# Altium project CPLDTester.PrjPCB
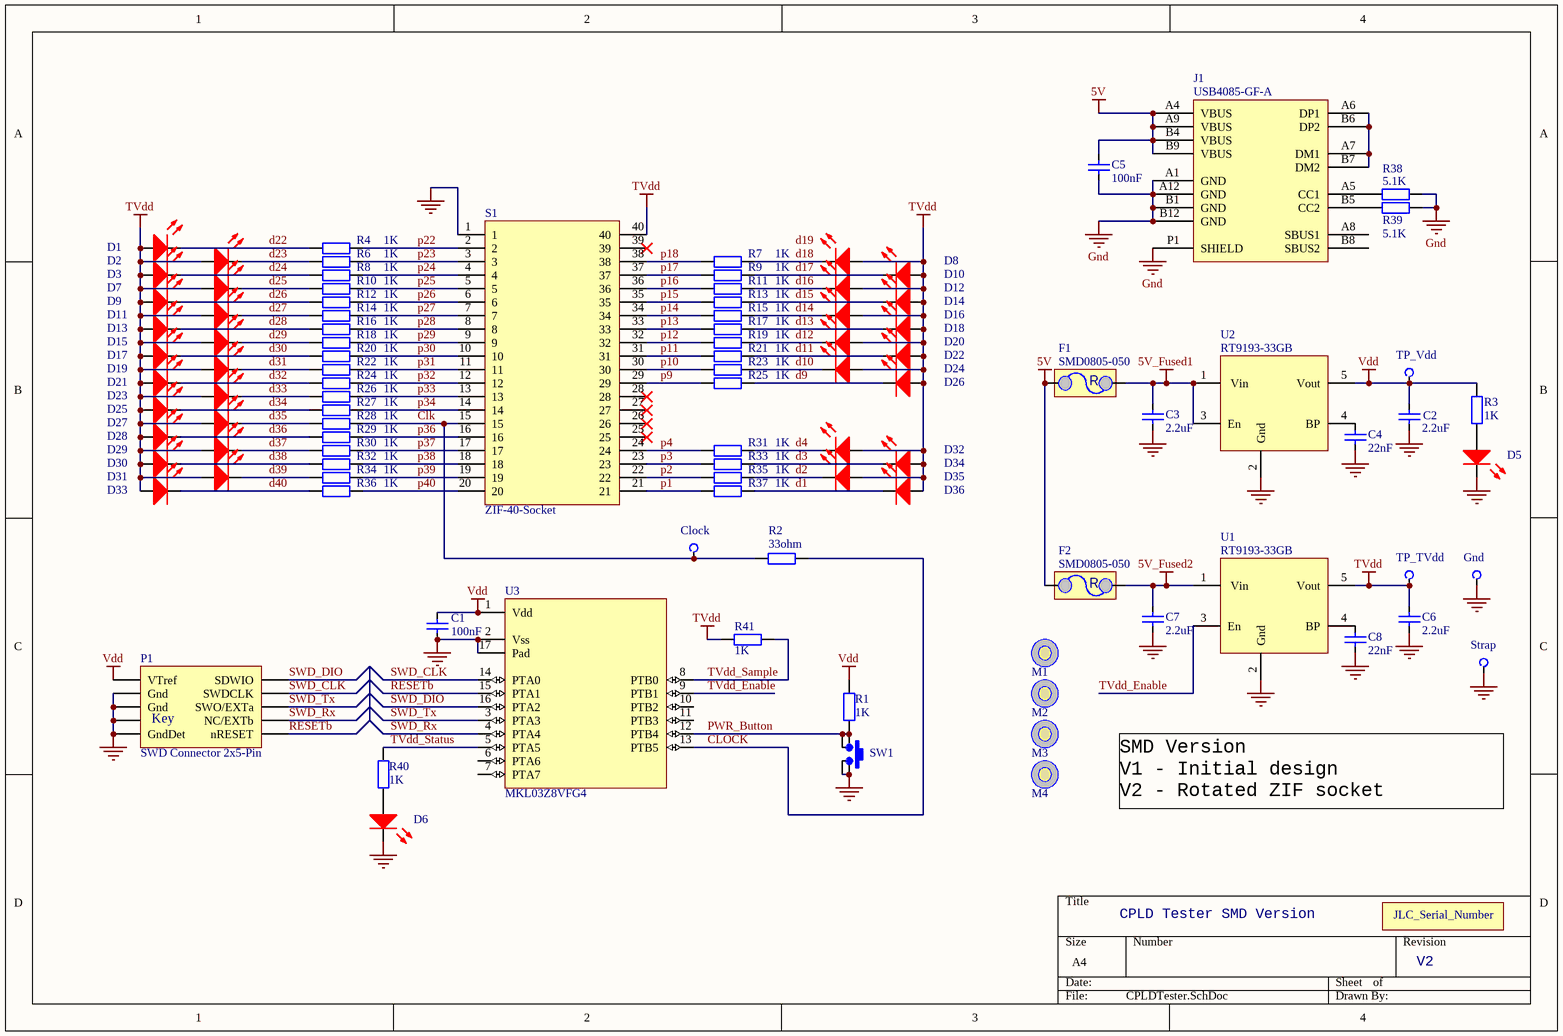
[diagram p0: CPLDTester.SchDoc]
ProjectDescription: CPLD Tester SMD Version; ProjectRevision: V2
1 sheet, 102 parts. Net scope: global (net labels, ports and power ports of the same name join across sheets).
Board file: CPLDTester.PcbDoc

## Sheet CPLDTester.SchDoc
size A4

### Parts
C1  100nF  [CCNP1608-0603]
C2  2.2uF  [CCNP1608-0603]
C3  2.2uF  [CCNP1608-0603]
C4  22nF  [CCNP1608-0603]
C5  100nF  [CCNP1608-0603]
C6  2.2uF  [CCNP1608-0603]
C7  2.2uF  [CCNP1608-0603]
C8  22nF  [CCNP1608-0603]
Clock  Clock  [PCBPIN - 0.9mm]  (value not drawn)
D1  LED Red  [LED1608-0603-RED]  (value not drawn)
D2  LED Red  [LED1608-0603-RED]  (value not drawn)
D3  LED Red  [LED1608-0603-RED]  (value not drawn)
D5  LED Red  [LED1608-0603-RED]  (value not drawn)
D6  LED Red  [LED1608-0603-RED]  (value not drawn)
D7  LED Red  [LED1608-0603-RED]  (value not drawn)
D8  LED Red  [LED1608-0603-RED]  (value not drawn)
D9  LED Red  [LED1608-0603-RED]  (value not drawn)
D10  LED Red  [LED1608-0603-RED]  (value not drawn)
D11  LED Red  [LED1608-0603-RED]  (value not drawn)
D12  LED Red  [LED1608-0603-RED]  (value not drawn)
D13  LED Red  [LED1608-0603-RED]  (value not drawn)
D14  LED Red  [LED1608-0603-RED]  (value not drawn)
D15  LED Red  [LED1608-0603-RED]  (value not drawn)
D16  LED Red  [LED1608-0603-RED]  (value not drawn)
D17  LED Red  [LED1608-0603-RED]  (value not drawn)
D18  LED Red  [LED1608-0603-RED]  (value not drawn)
D19  LED Red  [LED1608-0603-RED]  (value not drawn)
D20  LED Red  [LED1608-0603-RED]  (value not drawn)
D21  LED Red  [LED1608-0603-RED]  (value not drawn)
D22  LED Red  [LED1608-0603-RED]  (value not drawn)
D23  LED Red  [LED1608-0603-RED]  (value not drawn)
D24  LED Red  [LED1608-0603-RED]  (value not drawn)
D25  LED Red  [LED1608-0603-RED]  (value not drawn)
D26  LED Red  [LED1608-0603-RED]  (value not drawn)
D27  LED Red  [LED1608-0603-RED]  (value not drawn)
D28  LED Red  [LED1608-0603-RED]  (value not drawn)
D29  LED Red  [LED1608-0603-RED]  (value not drawn)
D30  LED Red  [LED1608-0603-RED]  (value not drawn)
D31  LED Red  [LED1608-0603-RED]  (value not drawn)
D32  LED Red  [LED1608-0603-RED]  (value not drawn)
D33  LED Red  [LED1608-0603-RED]  (value not drawn)
D34  LED Red  [LED1608-0603-RED]  (value not drawn)
D35  LED Red  [LED1608-0603-RED]  (value not drawn)
D36  LED Red  [LED1608-0603-RED]  (value not drawn)
F1  SMD0805-050  [SMD0805-050]
F2  SMD0805-050  [SMD0805-050]
Gnd  TP  [PCBPIN - 0.9mm]  (value not drawn)
J1  USB4085-GF-A  [USB4085-GF-A]
JLC_Serial_Number  JLC_Serial_Number  [JLC_Serial_Number]  (value not drawn)  (no BOM)
M1  Plastic Bumper  [Bumper_RBS-2]  (value not drawn)
M2  Plastic Bumper  [Bumper_RBS-2]  (value not drawn)
M3  Plastic Bumper  [Bumper_RBS-2]  (value not drawn)
M4  Plastic Bumper  [Bumper_RBS-2]  (value not drawn)
P1  SWD Connector 2x5-Pin  [SWD-2x5-Jig-Pads]  (no BOM)
R1  1K  [CR1608-0603]
R2  33ohm  [CR1608-0603]
R3  1K  [CR1608-0603]
R4  1K  [CR1608-0603]
R6  1K  [CR1608-0603]
R7  1K  [CR1608-0603]
R8  1K  [CR1608-0603]
R9  1K  [CR1608-0603]
R10  1K  [CR1608-0603]
R11  1K  [CR1608-0603]
R12  1K  [CR1608-0603]
R13  1K  [CR1608-0603]
R14  1K  [CR1608-0603]
R15  1K  [CR1608-0603]
R16  1K  [CR1608-0603]
R17  1K  [CR1608-0603]
R18  1K  [CR1608-0603]
R19  1K  [CR1608-0603]
R20  1K  [CR1608-0603]
R21  1K  [CR1608-0603]
R22  1K  [CR1608-0603]
R23  1K  [CR1608-0603]
R24  1K  [CR1608-0603]
R25  1K  [CR1608-0603]
R26  1K  [CR1608-0603]
R27  1K  [CR1608-0603]
R28  1K  [CR1608-0603]
R29  1K  [CR1608-0603]
R30  1K  [CR1608-0603]
R31  1K  [CR1608-0603]
R32  1K  [CR1608-0603]
R33  1K  [CR1608-0603]
R34  1K  [CR1608-0603]
R35  1K  [CR1608-0603]
R36  1K  [CR1608-0603]
R37  1K  [CR1608-0603]
R38  5.1K  [CR1608-0603]
R39  5.1K  [CR1608-0603]
R40  1K  [CR1608-0603]
R41  1K  [CR1608-0603]
S1  ZIF-40-Socket  [ZIF40]
Strap  TP  [PCBPIN - 1mm]  (value not drawn)
SW1  SMD-SW-4_5.1x5.1x2.0  [SMD-SW-4_5.1x5.1x2.0]  (value not drawn)
TP_TVdd  TVdd  [PCBPIN - 0.9mm]  (value not drawn)  (no BOM)
TP_Vdd  Vdd  [PCBPIN - 0.9mm]  (value not drawn)  (no BOM)
U1  RT9193-33GB  [SOT23-5]
U2  RT9193-33GB  [SOT23-5]
U3  MKL03Z8VFG4  [QFN-16]

### Nets
5V: C5.2 F1.1 F2.1 J1.A4(VBUS) J1.A9(VBUS) J1.B4(VBUS) J1.B9(VBUS)
5V_Fused1: C3.2 F1.2 U2.1(Vin) U2.3(En)
5V_Fused2: C7.2 F2.2 U1.1(Vin)
GND: C1.1 C2.1 C3.1 C4.1 C5.1 C6.1 C7.1 C8.1 D5.K D6.K Gnd.1(TP) J1.A1(GND) J1.A12(GND) J1.B1(GND) J1.B12(GND) J1.P1(SHIELD) P1.0(Pins) P1.3(Gnd) P1.5(Gnd) P1.9(GndDet) R38.2 R39.2 S1.1 Strap.1(TP) SW1.1 SW1.1b U1.2(Gnd) U2.2(Gnd) U3.2(Vss) U3.17(Pad)
TVdd: C6.2 D1.A D2.A D3.A D7.A D8.A D9.A D10.A D11.A D12.A D13.A D14.A D15.A D16.A D17.A D18.A D19.A D20.A D21.A D22.A D23.A D24.A D25.A D26.A D27.A D28.A D29.A D30.A D31.A D32.A D33.A D34.A D35.A D36.A R41.2 S1.40 TP_TVdd.1(TP) U1.5(Vout)
Vdd: C1.2 C2.2 P1.1(VTref) R1.2 R3.2 TP_Vdd.1(TP) U2.5(Vout) U3.1(Vdd)
Clk: Clock.1(TP) R2.2 R28.2 S1.15
CLOCK: R2.1 U3.13(PTB5)
d1: D36.K R37.2
d2: D35.K R35.2
d3: D34.K R33.2
d4: D32.K R31.2
d9: D26.K R25.2
d10: D24.K R23.2
d11: D22.K R21.2
d12: D20.K R19.2
d13: D18.K R17.2
d14: D16.K R15.2
d15: D14.K R13.2
d16: D12.K R11.2
d17: D10.K R9.2
d18: D8.K R7.2
d22: D1.K R4.1
d23: D2.K R6.1
d24: D3.K R8.1
d25: D7.K R10.1
d26: D9.K R12.1
d27: D11.K R14.1
d28: D13.K R16.1
d29: D15.K R18.1
d30: D17.K R20.1
d31: D19.K R22.1
d32: D21.K R24.1
d33: D23.K R26.1
d34: D25.K R27.1
d35: D27.K R28.1
d36: D28.K R29.1
d37: D29.K R30.1
d38: D30.K R32.1
d39: D31.K R34.1
d40: D33.K R36.1
p1: R37.1 S1.21
p2: R35.1 S1.22
p3: R33.1 S1.23
p4: R31.1 S1.24
p9: R25.1 S1.29
p10: R23.1 S1.30
p11: R21.1 S1.31
p12: R19.1 S1.32
p13: R17.1 S1.33
p14: R15.1 S1.34
p15: R13.1 S1.35
p16: R11.1 S1.36
p17: R9.1 S1.37
p18: R7.1 S1.38
p22: R4.2 S1.2
p23: R6.2 S1.3
p24: R8.2 S1.4
p25: R10.2 S1.5
p26: R12.2 S1.6
p27: R14.2 S1.7
p28: R16.2 S1.8
p29: R18.2 S1.9
p30: R20.2 S1.10
p31: R22.2 S1.11
p32: R24.2 S1.12
p33: R26.2 S1.13
p34: R27.2 S1.14
p36: R29.2 S1.16
p37: R30.2 S1.17
p38: R32.2 S1.18
p39: R34.2 S1.19
p40: R36.2 S1.20
PWR_Button: R1.1 SW1.2 SW1.2b U3.12(PTB4)
RESETb: P1.10(nRESET) U3.15(PTA1)
SWD_CLK: P1.4(SWDCLK) U3.14(PTA0)
SWD_DIO: P1.2(SDWIO) U3.16(PTA2)
SWD_Rx: P1.8(NC/EXTb) U3.4(PTA4)
SWD_Tx: P1.6(SWO/EXTa) U3.3(PTA3)
TVdd_Enable: U1.3(En) U3.9(PTB1)
TVdd_Sample: R41.1 U3.8(PTB0)
TVdd_Status: R40.2 U3.5(PTA5)
NetC4_2: C4.2 U2.4(BP)
NetC8_2: C8.2 U1.4(BP)
NetD5_A: D5.A R3.1
NetD6_A: D6.A R40.1
NetJ1_A5: J1.A5(CC1) R38.1
NetJ1_A6: J1.A6(DP1) J1.A7(DM1) J1.B6(DP2) J1.B7(DM2)
NetJ1_B5: J1.B5(CC2) R39.1

Not connected (* = marked no-connect by the designer): J1 A8(SBUS1) B8(SBUS2); S1 25* 26* 27* 28* 39*; U3 6(PTA6) 7(PTA7) 10(PTB2) 11(PTB3)

### Notes on the sheet
- SMD Version
  V1 - Initial design
  V2 - Rotated ZIF socket
- Labels drawn without touching a wire or pin: d19
- (in symbol SMD0805-050) R
- (in symbol SWD2X5_JIG) Key

### Library data of the parts
C1 = Cap: Capacitor SMT; Manufacturer: Generic Components; Class: Passive; Published: 08/06/2000; Publisher: Altium Hobart Technology Centre; SubClass: Capacitor; Value: 100nF; Farnell PN: 1186187; LCSC: C14663
C2-C4 C6-C8 = Cap: Capacitor; Manufacturer: Generic Components; Class: Passive; Published: 08/06/2000; Publisher: Altium Hobart Technology Centre; SubClass: Capacitor; Farnell PN: *; Digikey: *
  C2 C3 C6 C7: Value: 2.2uF; LCSC: C23630
  C4 C8: Value: 22nF; LCSC: C21122
C5 = Cap_CCNP_0603: Capacitor non-polar SMT 0603; Manufacturer: Generic Components; Class: Passive; Published: 08/06/2000; Publisher: Altium Hobart Technology Centre; SubClass: Capacitor; Farnell PN: *; Digikey: *; Value: 100nF; LCSC: C14663
Clock Gnd Strap TP_TVdd TP_Vdd = TP: Test Point; Digikey: *; Farnell PN: *
D1-D3 D5-D36 = LED-0603-Red: LED 0603 Red; Manufacturer: Generic Components; Class I: Optoelectronic; Published: 8-Jun-2000; Revision: July-2002: Re-released for DXP Platform.; Publisher: Altium Limited; Class II: LED; Farnell PN: 1581239; Digikey: *; LCSC: C2286
F1 F2 = SMD0805-050: PTC Resetable Fuse 0805 0.5A hold; LCSC: C66452
J1 = USB4085-GF-A: USB-C, USB 2.0 Receptacle Connector 16 Position Through Hole, Right Angle; Angle: 90; Part Number: USB4085-GF-A; Digikey Part Number: 2073-USB4085-GF-ACT-ND; Digikey Link: https://www.digikey.ee/product-detail/en/gct/USB4085-GF-A/2073-USB4085-GF-ACT-ND/9859733; Digikey: 2073-USB4085-GF-ACT-ND; Farnell PN: 2924867; LCSC: *
M1-M4 = Mounting_Feet: Plastic bumper/foot; Digikey: RPC4821-ND; Farnell PN: *
P1 = SWD2X5_JIG: LatestRevisionDate: 17-Jul-2002; LatestRevisionNote: Re-released for DXP Platform.; Publisher: Altium Limited; Farnell PN: 1865285; LCSC: *
R1-R4 R6-R41 = Res_CR0603: Resistor SMT 0603; Manufacturer: Generic Components; Class: Passive; Published: 08/06/2000; Publisher: Altium Hobart Technology Centre; SubClass: Resistor; Farnell PN: *; Digikey: *
  R1 R3 R4 R6-R37 R40 R41: Value: 1K; LCSC: C21190
  R2: Value: 33ohm; LCSC: C23140
  R38 R39: Value: 5.1K; LCSC: C23186
SW1 = SW_PB-TS: Tactile Switch SPST 5.10mm X 5.10mm; Revision: 1.0; LCSC: C318888
U1 U2 = RT9193-33GB: 3.3V 300mA low noise LDO with enable, uses low ESR cap (ceramic); LCSC: C15651; Farnell PN: 2377665; Digikey: 1028-1014-1-ND
U3 = MKL03Z8VFG4: MCU 32-Bit KL03 ARM Cortex M0+ RISC 8KB Flash 1.8V/2.5V/3.3V 16-Pin QFN; LCSC: C159845